# Altium schematic sheet 05_Buzzer.SchDoc
size A; SPICEModelCacheOKCZUNHO: <root> / <DocumentId>OKCZUNHO</DocumentId> / <CacheFrame Number="0"> / <Model Name="10tq035" Kind="MDL"> / <Text>*10TQ035 MCE 3/26/98 / *Ref: IR Power Semiconductors Product Digest '94 / *MCE 35V 10A 3us pkg:TO-220 3,1 / .MODEL 10TQ035 D (IS=14.2N RS=4.2M N=1.7 BV=35 IBV=15M / + CJO=412P VJ=0.75 M=0.333 TT=4.32U EG=.69 XTI=2)</Text> / </Model> / </CacheFrame> / </root>
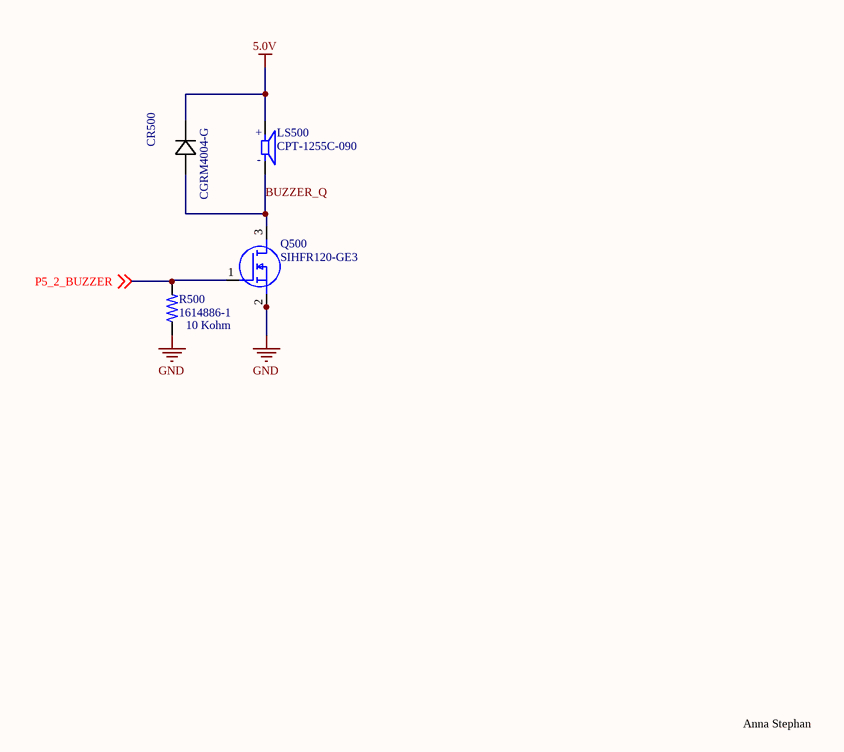
[diagram p0: 05_Buzzer.SchDoc]

## Parts
CR500  CGRM4004-G  [CGRM]
LS500  CPT-1255C-090  [CUI_CPT-1255C-090]
Q500  SIHFR120-GE3  [SIHFR120GE3]
R500  1614886-1  [RESC2012X65N]

## Nets
5.0V: CR500.1 LS500.P
GND: Q500.2(S) R500.1
BUZZER_Q: CR500.2 LS500.N Q500.3(D)
P5_2_BUZZER: Q500.1(G) R500.2 ; off-sheet P5_2_BUZZER

## Notes on the sheet
- (near R500) 10 Kohm
- Anna Stephan
- (in symbol CPT-1255C-090) +; -

## Library data of the parts
CR500 = CGRM4004-G: No Description Available; Mfr_Name: Comchip; Type: DEV; Copyright: Copyright (C) 2022 Ultra Librarian. All rights reserved.; Manufacturer_Part_Number: CGRM4004-G; Digi-Key_Part_Number_1: 641-1329-1-ND; Digi-Key_Part_Number_2: 641-1329-2-ND; Digi-Key_Part_Number_3: 641-1329-2-NDL; Digi-Key_Part_Number_4: 641-1329-6-ND; RefDes: RefDes
LS500 = CPT-1255C-090: 12 mm, 20 Vp-p, 80 dB, Through Hole, Piezo Audio Transducer Buzzer; MF: CUI Devices; SnapEDA_Link: https://www.snapeda.com/parts/CPT-1255C-090/CUI%20Devices/view-part/2202985/?ref=snap; MP: CPT-1255C-090; Availability: Unavailable; Price: None; Value: *; Manufacturer: CUI Devices; Manufacturer Part No.: CPT-1255C-090; Digikey Part No.: 102-3752-ND
Q500 = SIHFR120-GE3: MOSFET (N-Channel); Manufacturer_Name: Vishay; Datasheet Link: https://www.mouser.in/datasheet/2/427/91266-1768752.pdf; Height: 2.38mm; Mouser2 Part Number: 78-SIHFR120-GE3; Manufacturer_Part_Number: SIHFR120-GE3
R500 = 1614886-1: CPF0805 10K 0.1% 25PPM 5K RL; Power_Rating: .1 W; Tolerance: .1%; Voltage_Rating: 100 V; MF: TE Connectivity; Availability: Warning; Price: None; Package: 0805; MP: 1614886-1; Value: *; EU_RoHS_Compliance: Compliant; SnapEDA_Link: https://www.snapeda.com/parts/1614886-1/TE%20Connectivity/view-part/2202344/?ref=snap; Resistance: 10K; Check_prices: https://www.snapeda.com/parts/1614886-1/TE%20Connectivity/view-part/2202344/?ref=eda